# EAGLE design Omega2-IO-Power (EAGLE 7.7.0)
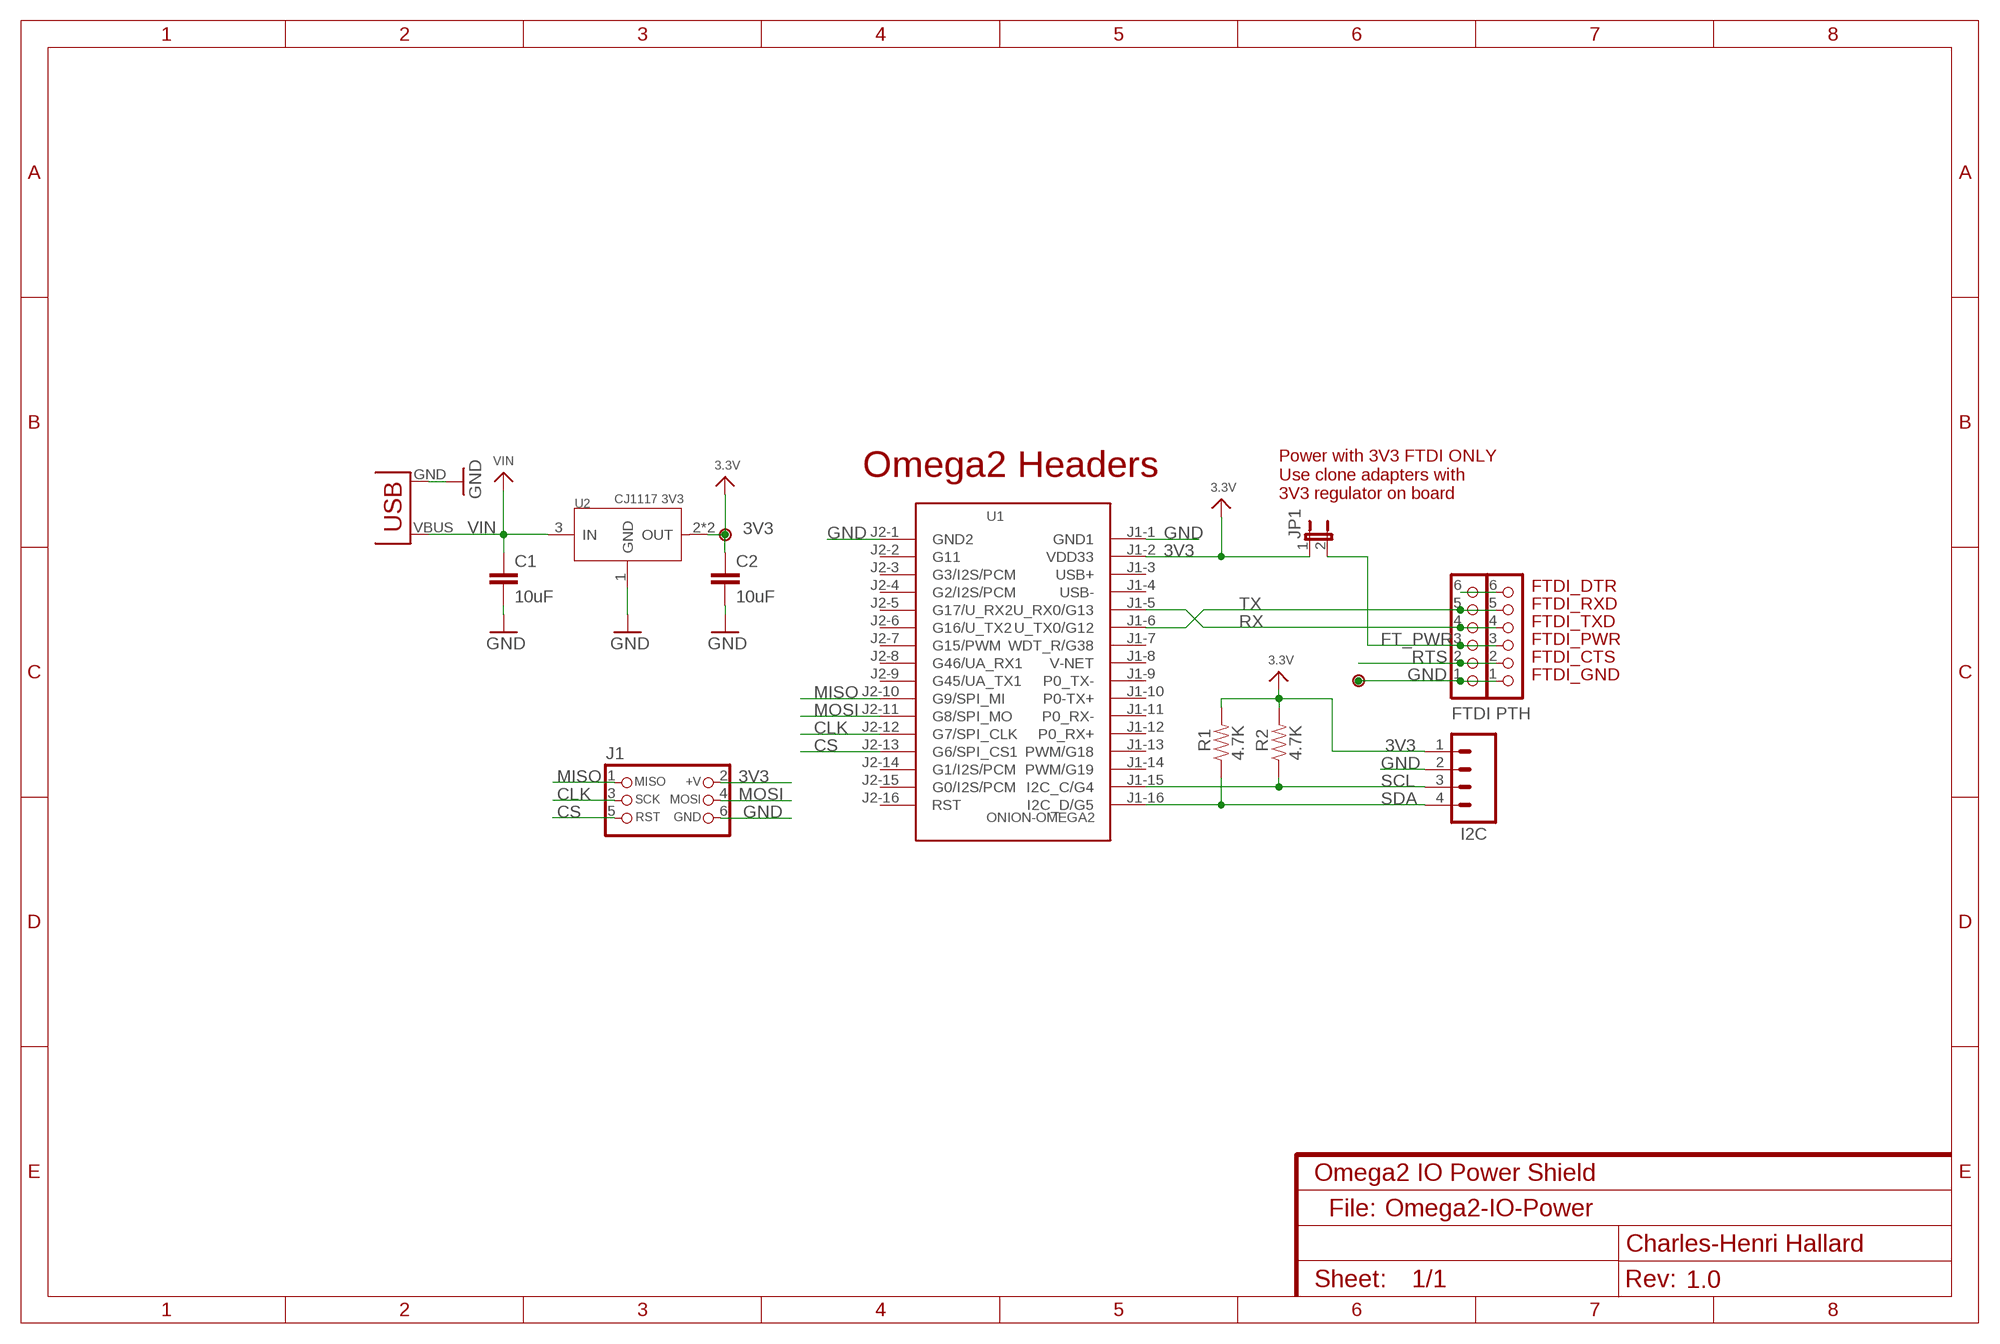
[diagram p0: schematic, sheet 1]
NAME (FRAME-A4L): CNAME: Omega2 IO Power Shield; CREVISION: 1.0; DESIGNER: Charles-Henri Hallard

## Parts
C1  10uF  CAP0805-CAP-LARGEPADS  [0805-CAP-LARGEPADS]
C2  10uF  CAP0805-CAP-LARGEPADS  [0805-CAP-LARGEPADS]
FTDI  CON_HEADER_1X06-PTH  [M1X6]
I2C  M04PTH  [1X04]
J1  CON_HEADER_PRG_AVR_ICSP-PTH  [HEADER_PRG_2X03]
JP1  JUMPER2  [JUMPER2]
P1  PADNORMAL  [PAD]
P2  PADNORMAL  [PAD]
PTH  CON_HEADER_1X06  [M1X6_MALE_RIGHT_ANGLED_SMD_NO_HOLES]
R1  4.7K  RESISTOR0805-RES  [0805-RES]
R2  4.7K  RESISTOR0805-RES  [0805-RES]
U1  ONION-OMEGA2  [ONION-2MM-2X16]
U2  CJ1117 3V3  CJ1117-3.3-1310120P1  [SOT89]
USB  USB_POWER  [USB_MINIB_POWER]

## Nets
3V3: C2.1 I2C.1 J1.2(+V) JP1.1 P1.1 R1.2 R2.2 U1.J1-2(VDD33) U2.2(OUT) U2.4(OUT) ; supply symbol labelled 3.3V
CLK: J1.3(SCK) U1.J2-12(G7/SPI_CLK)
CS: J1.5(RST) U1.J2-13(G6/SPI_CS1)
FT_PWR: FTDI.3 JP1.2 PTH.3
GND: C1.2 C2.2 FTDI.1 I2C.2 J1.6(GND) P2.1 PTH.1 U1.J1-1(GND1) U1.J2-1(GND2) U2.1(GND) USB.GND
MISO: J1.1(MISO) U1.J2-10(G9/SPI_MI)
MOSI: J1.4(MOSI) U1.J2-11(G8/SPI_MO)
RST: FTDI.6 PTH.6
RTS: FTDI.2 PTH.2
RX: FTDI.4 PTH.4 U1.J1-5(U_RX0/G13)
SCL: I2C.3 R2.1 U1.J1-15(I2C_C/G4)
SDA: I2C.4 R1.1 U1.J1-16(I2C_D/G5)
TX: FTDI.5 PTH.5 U1.J1-6(U_TX0/G12)
VIN: C1.1 U2.3(IN) USB.VBUS(VCC)
Unconnected: U1.J1-3(USB+) U1.J1-4(USB-) U1.J1-7(WDT_R/G38) U1.J1-8(V-NET) U1.J1-9(P0_TX-) U1.J1-10(P0-TX+) U1.J1-11(P0_RX-) U1.J1-12(P0_RX+) U1.J1-13(PWM/G18) U1.J1-14(PWM/G19) U1.J2-2(G11) U1.J2-3(G3/I2S/PCM) U1.J2-4(G2/I2S/PCM) U1.J2-5(G17/U_RX2) U1.J2-6(G16/U_TX2) U1.J2-7(G15/PWM) U1.J2-8(G46/UA_RX1) U1.J2-9(G45/UA_TX1) U1.J2-14(G1/I2S/PCM) U1.J2-15(G0/I2S/PCM) U1.J2-16(RST)

## Notes on the sheet
- Omega2 Headers
- Power with 3V3 FTDI ONLY
  Use clone adapters with
  3V3 regulator on board
- FTDI_DTR
- FTDI_RXD
- FTDI_TXD
- FTDI_PWR
- FTDI_CTS
- FTDI_GND
- File:

## Library data of the parts
C1 C2 = _c2h:CAP: Capacitor Standard 0603 ceramic capacitor, and 0.1" leaded capacitor.
FTDI PTH = _c2h:CON_HEADER_1X06
I2C = SparkFun-Connectors:M04: Header 4 Standard 4-pin 0.1" header. Use with straight break away headers (SKU : PRT-00116), right angle break away headers (PRT-00553), swiss pins (PRT-00743), machine pins (PRT-00117), and female headers (PRT-00115). Molex polarized connector foot print use with SKU : PRT-08231 with associated crimp pins and housings. 1MM SMD Version SKU: PRT-10208
J1 = dp_devices:CON_HEADER_PRG_AVR_ICSP: 2x3 AVR ICSP programming header
JP1 = microbuilder:JUMPER2: JUMPER - 2 Pins
P1 P2 = _c2h:PAD
R1 R2 = _c2h:RESISTOR: Resistor Basic schematic elements and footprints for 0603, 1206, and PTH resistors.
U1 = Onion2:ONION-OMEGA2: Onion Omega
U2 = Seeed-IC:CJ1117-3.3: 1A Low Dropout Linear Regulator
USB = _c2h:USB_POWER

## Net classes
0 default: width 0.203 mm, drill 0.356 mm, clearance 0.152 mm
1 power: width 0.203 mm, clearance 0.152 mm

## Board
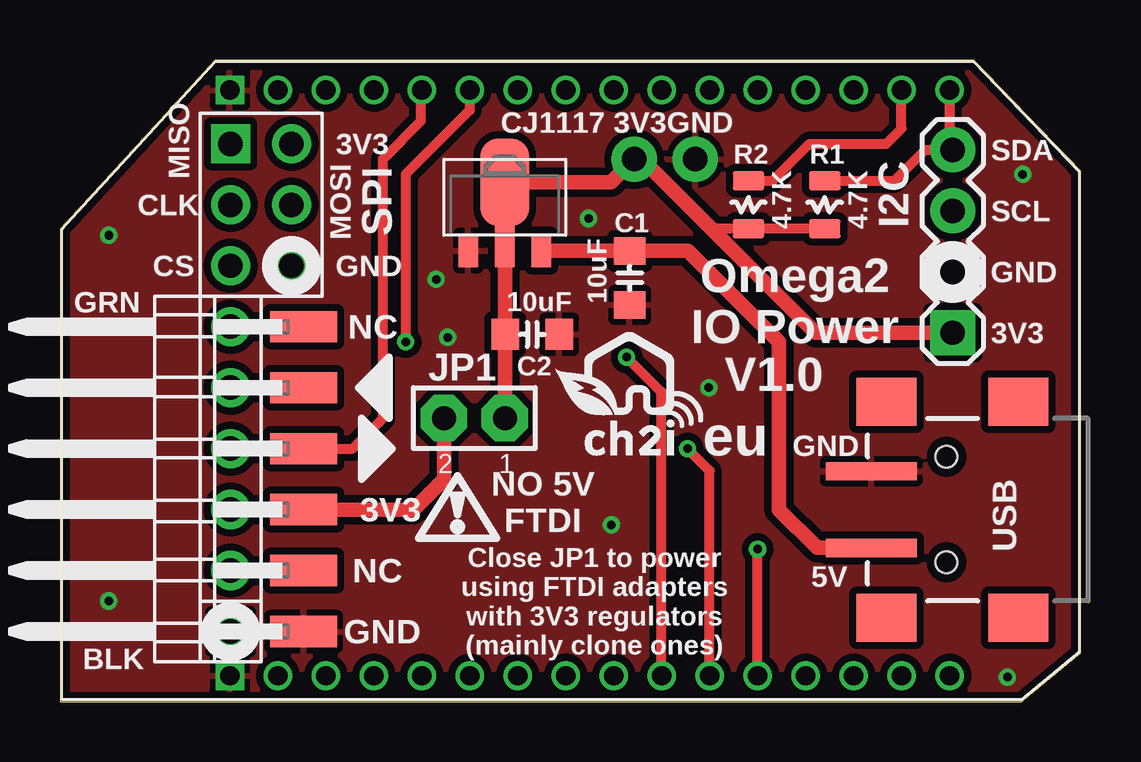
[diagram p1: board, top side]
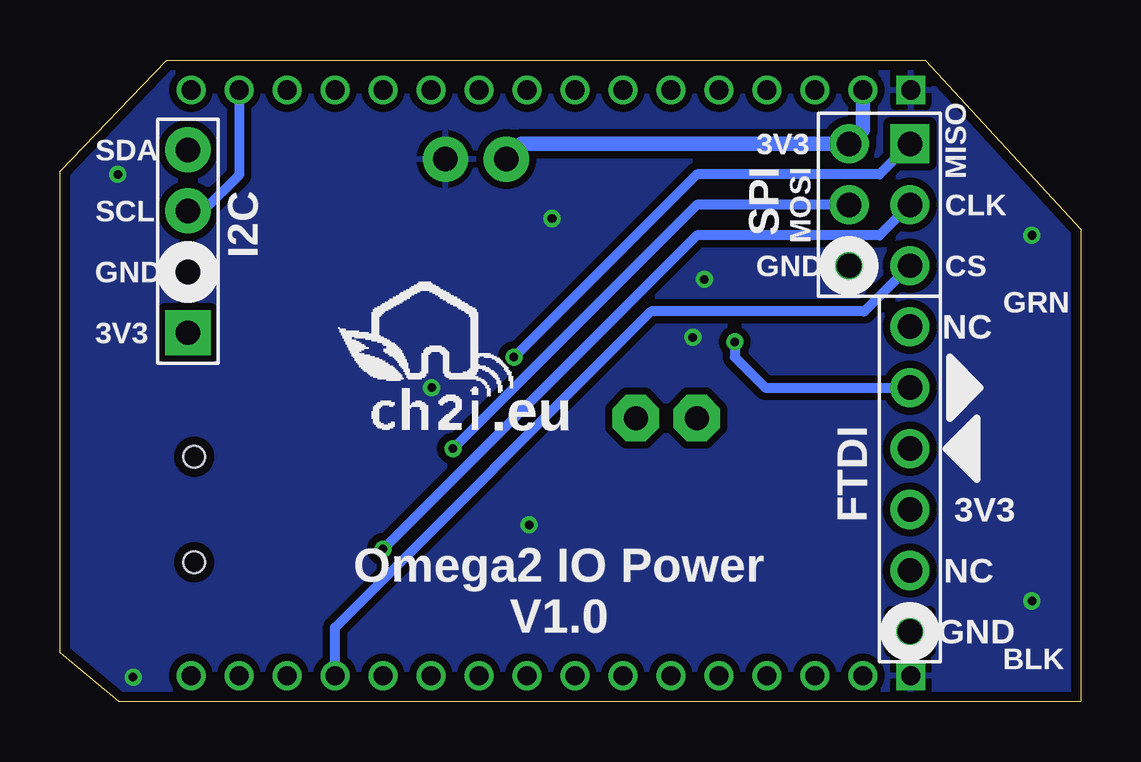
[diagram p2: board, bottom side, seen from below]

Size 42.55 x 26.73 mm. Coordinates in mm from the lower left corner, seen from the top.
Outline: 0,19.68 0,0 40.07,0 42.55,2.03 42.55,22.1 38.1,26.73 6.48,26.73 0,19.68
Copper layers (1*16): Top 0.0356mm / dielectric 1.5011mm / Bottom 0.0356mm
Design rules "PCBs_io": minimum track width 6mil, minimum drill 13mil, track to track 6mil, track to pad 6mil, pad to pad 6mil, via to via 6mil, smd to smd 6mil, copper to edge 15mil, drill to drill 6mil, minimum pad ring 7mil, minimum via ring 7mil, stop-mask expansion 3mil, vias tented up to drill 40mil, thermal gap 10mil

### Footprints (pad centres in the part's own frame; a part is rotated, then mirrored left to right if it is on the bottom)
0805-CAP-LARGEPADS = smd 1.156 x 1.3: 1 -1.127,0; 2 1.127,0
M1X6 = drill 1.02 pad 1.632 square: 1 0,0 | drill 1.02 pad 1.632: 2 2.54,0; 3 5.08,0; 4 7.62,0; 5 10.16,0; 6 12.7,0
1X04 = drill 1.016 pad 1.88 square: 1 0,0 | drill 1.016 pad 1.88: 2 2.54,0; 3 5.08,0; 4 7.62,0
HEADER_PRG_2X03 = drill 1.02 pad 1.632 square: 1 -2.54,-1.27 | drill 1.02 pad 1.632: 2 -2.54,1.27; 3 0,-1.27; 4 0,1.27; 5 2.54,-1.27; 6 2.54,1.27
JUMPER2 = drill 1 pad 1.93 octagon: 1 2.54,0; 2 0,0
PAD = drill 1.016 pad 1.88: 1 0,0
M1X6_MALE_RIGHT_ANGLED_SMD_NO_HOLES = smd 1.3 x 2.8: 1 -6.35,-4.951; 2 -3.81,-4.951; 3 -1.27,-4.951; 4 1.27,-4.951; 5 3.81,-4.951; 6 6.35,-4.951
0805-RES = smd 0.8 x 1.3: 1 -1,0; 2 1,0
ONION-2MM-2X16 = drill 0.8 square: J1-1 12.4,14; J2-1 -12,14 | drill 0.8: J1-2 12.4,12; J1-3 12.4,10; J1-4 12.4,8; J1-5 12.4,6; J1-6 12.4,4; J1-7 12.4,2; J1-8 12.4,0; J1-9 12.4,-2; J1-10 12.4,-4; J1-11 12.4,-6; J1-12 12.4,-8; J1-13 12.4,-10; J1-14 12.4,-12; J1-15 12.4,-14; J1-16 12.4,-16; J2-2 -12,12; J2-3 -12,10; J2-4 -12,8; J2-5 -12,6; J2-6 -12,4; J2-7 -12,2; J2-8 -12,0; J2-9 -12,-2; J2-10 -12,-4; J2-11 -12,-6; J2-12 -12,-8; J2-13 -12,-10; J2-14 -12,-12; J2-15 -12,-14; J2-16 -12,-16
SOT89 = smd 0.8 x 1.4: 1 -1.524,-1.905; 3 1.524,-1.905 | smd 0.8 x 1.9: 2 0,-1.651 | smd 2.032 x 3.65: 4 0,0.94
USB_MINIB_POWER = smd 3.81 x 0.762: GND 4.405,-1.6; VBUS 4.405,1.6 | smd 2.5 x 2: GND@1 -1.73,-4.5; GND@2 -1.73,4.5; GND@3 3.77,4.5; GND@4 3.77,-4.5 | hole 0.9: 1.27,2.2; 1.27,-2.2

### Placement (x,y rotation side)
C1  23.75,17.65 270 top
C2  19.69,15.3 0 top
FTDI  7.11,2.92 90 top
I2C  37.21,15.37 90 top
J1  8.38,20.7 270 top
JP1  16,11.81 0 top
P1  23.94,22.61 0 top
P2  26.48,22.61 0 top
PTH  5.21,9.27 90 top
R1  31.88,20.7 270 top
R2  28.7,20.7 270 top
U1  21.08,13.08 90 top
U2  18.54,20.7 0 top
U$2  [LOGO_C2I_015]  20.64,10.22 0 top
U$4  [LOGO_CH2I_75MM]  26.86,13.34 0 bottom
USB  38.23,8 180 top

### Tracks (layer width: path | path; a pad name or v marks a point on that pad's centre or on a via)
3V3
  Top 0.406: R1.2 R2.2 27.16,19.7 26.8,20.07
  Top 0.61: 19.16,21.62 U2.4 | U2.4 U2.2 18.54,15.32 C2.1 18.54,15.29 JP1.1 | I2C.1 31.5,15.37 26.8,20.07 24.26,22.61 P1.1 22.98,21.64 U2.4
  Bottom 0.61: U1.J1-2 9.08,23.81 J1.2 23.3,23.24 P1.1
CLK  (via drill 0.36 pad 0.71)
  Top 0.406: U1.J2-12 v29.08,6.35
  Bottom 0.406: J1.3 8.38,19.43 16,19.43 v29.08,6.35
CS
  Bottom 0.406: J1.5 9.02,16.26 17.91,16.26 31.08,3.08 U1.J2-13
FT_PWR
  Top 0.61: FTDI.3 PTH.3 14.73,8 16,9.27 JP1.2
GND  (via drill 0.36 pad 0.71)
  other vias: 2.03,19.43 2.03,4.19 39.5,1.02 40.13,21.97 22.99,7.37 27.05,13.08 22.03,20.13 15.68,17.59 16.16,15.18
  pour Bottom (isolate 0.305): 43.94,28.32 43.94,-0.89 -1.14,-0.89 -1.14,28.32
  pour Top (isolate 0.305): -0.51,27.69 43.31,27.69 43.31,-0.25 -0.51,-0.25
MISO  (via drill 0.36 pad 0.71)
  Top 0.406: U1.J2-10 25.08,12.89 v23.62,14.35
  Bottom 0.406: J1.1 8.38,21.97 16,21.97 v23.62,14.35
MOSI  (via drill 0.36 pad 0.71)
  Top 0.406: U1.J2-11 27.08,9.62 v26.16,10.54
  Bottom 0.406: J1.4 16,20.7 v26.16,10.54
RST
  Top 0.61: PTH.6 FTDI.6
RTS
  Top 0.61: PTH.2 FTDI.2
RX
  Top 0.406: PTH.4 12.19,10.54 13.46,11.81 13.46,22.61 15.05,24.19 15.05,25.45 U1.J1-5
  Top 0.61: PTH.4 FTDI.4
SCL
  Top 0.406: R2.1 29.7,21.7 31.24,23.24 34.45,23.24 35.08,23.88 U1.J1-15
  Bottom 0.406: U1.J1-15 35.08,21.94 36.58,20.45 I2C.3
SDA
  Top 0.406: U1.J1-16 37.08,23.12 I2C.4 37.2,22.97 36.05,22.97 34.78,21.7 R1.1
TX  (via drill 0.36 pad 0.71)
  Top 0.406: U1.J1-6 17.08,24.64 14.41,21.97 v14.41,14.99
  Top 0.61: PTH.5 FTDI.5
  Bottom 0.406: v14.41,14.99 14.41,14.35 13.14,13.08 FTDI.5
VIN
  Top 0.61: USB.VBUS 31.57,6.4 29.97,8 29.97,14.99 26.18,18.78 C1.1 24.37,18.8 U2.3

### Text on the board
tNames: GND | 3V3 | SDA | MISO | SPI | CLK | SCL | MOSI | CS | GND | GND | GRN | NC | Omega2 / IO Power | 3V3 | JP1 | V1.0 | eu | GND | 3V3 | NO 5V / FTDI | NC | 5V | Close JP1 to power / using FTDI adapters / with 3V3 regulators / (mainly clone ones) | GND | BLK
bNames: 3V3 | SDA | MISO | MOSI | SPI | I2C | CLK | SCL | CS | GND | GND | GRN | NC | 3V3 | .eu | FTDI | 3V3 | NC | Omega2 IO Power / V1.0 | GND | BLK